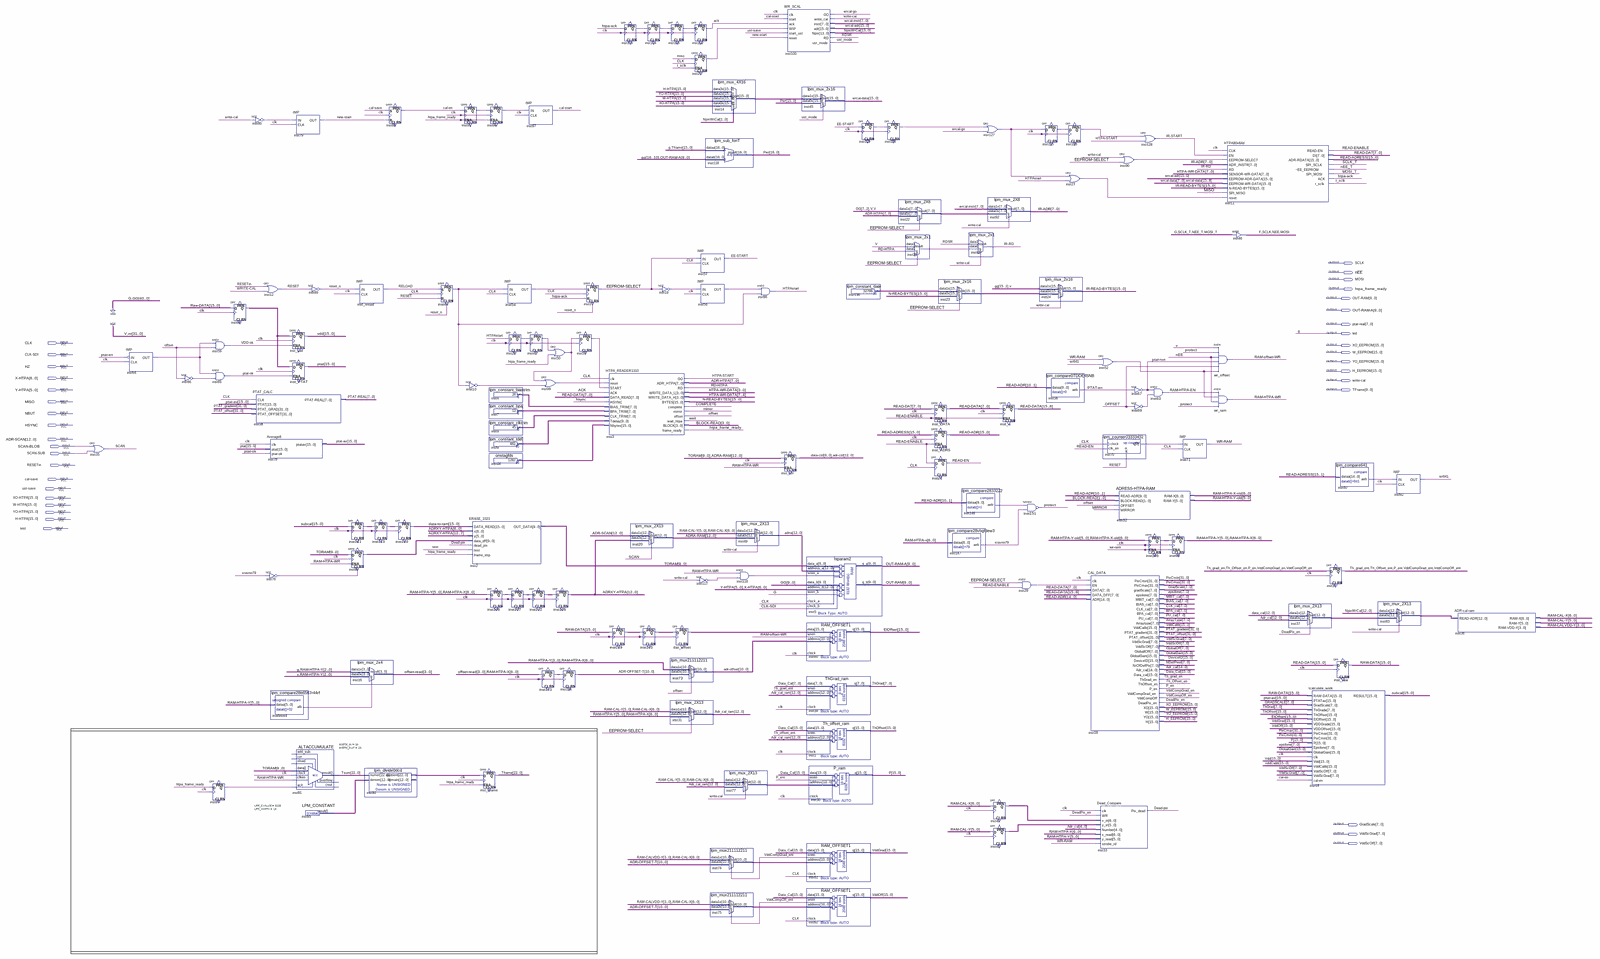
[diagram p0: schematic sheet, whole]
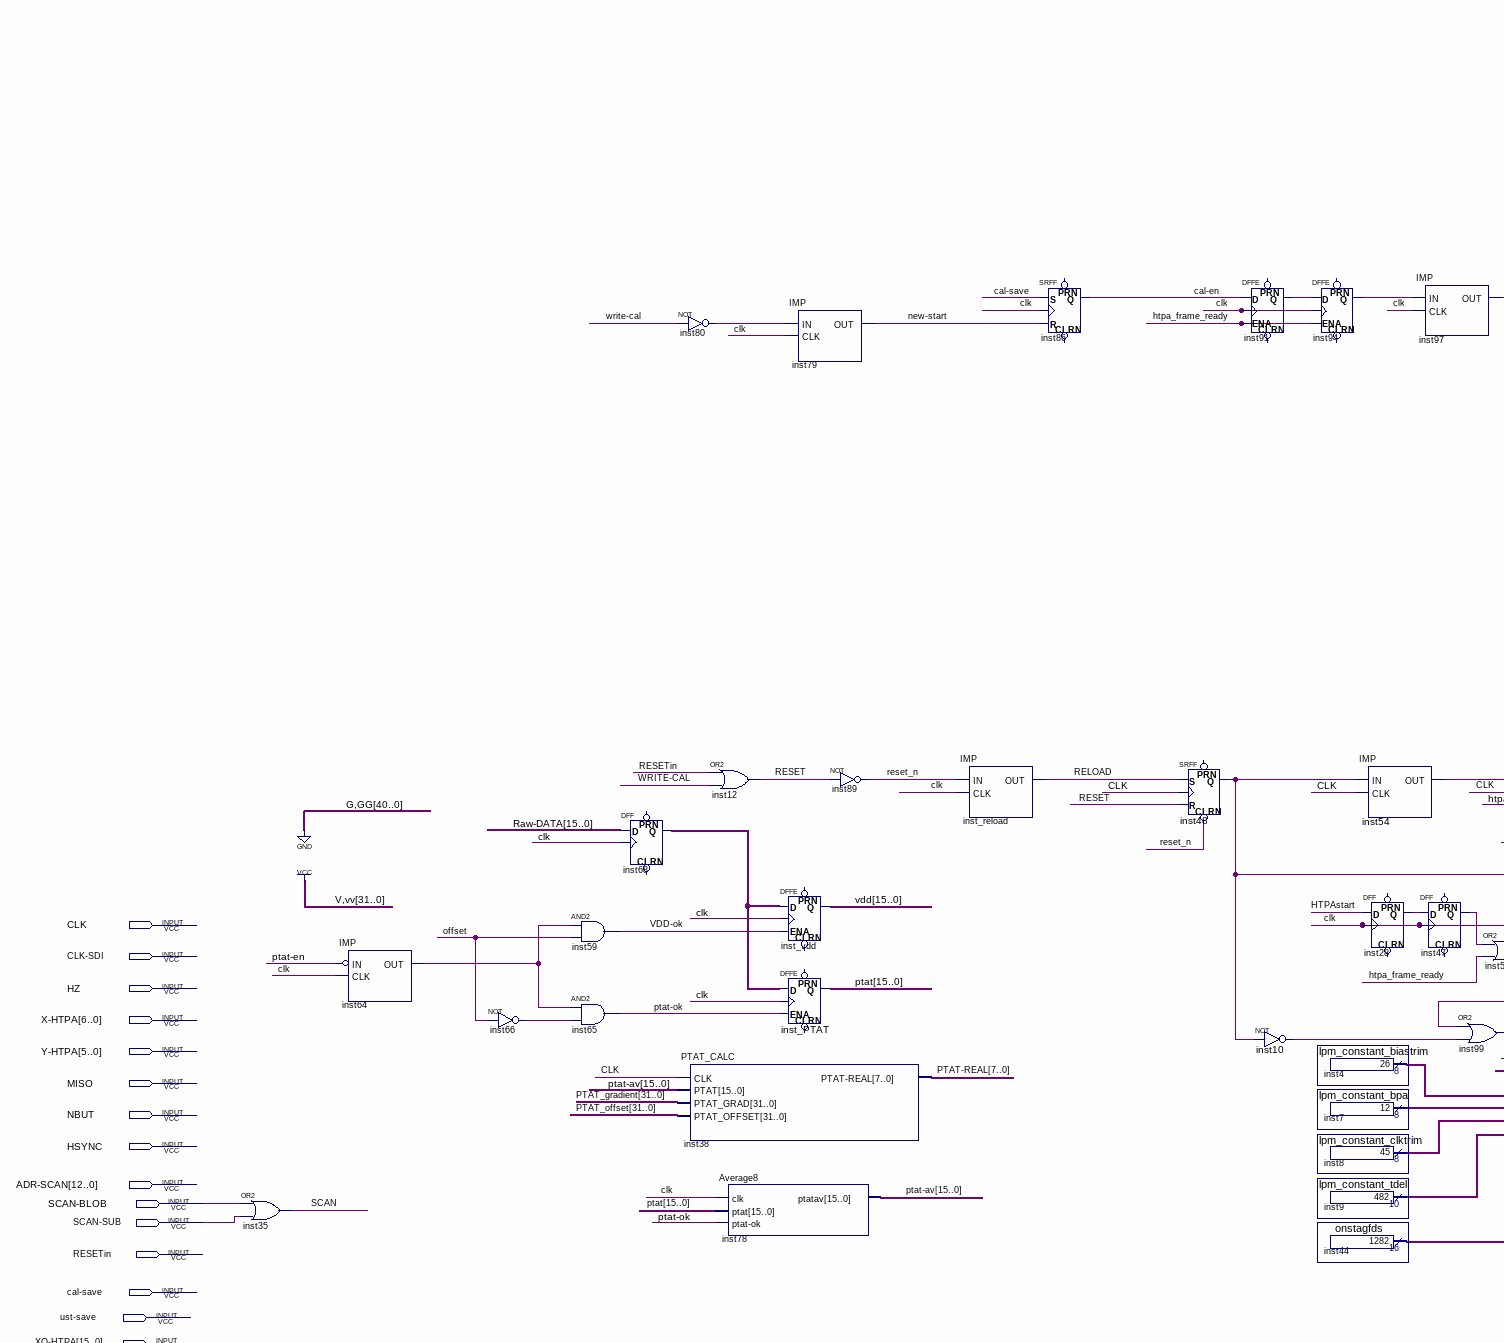
[diagram p1: schematic sheet, upper left part]
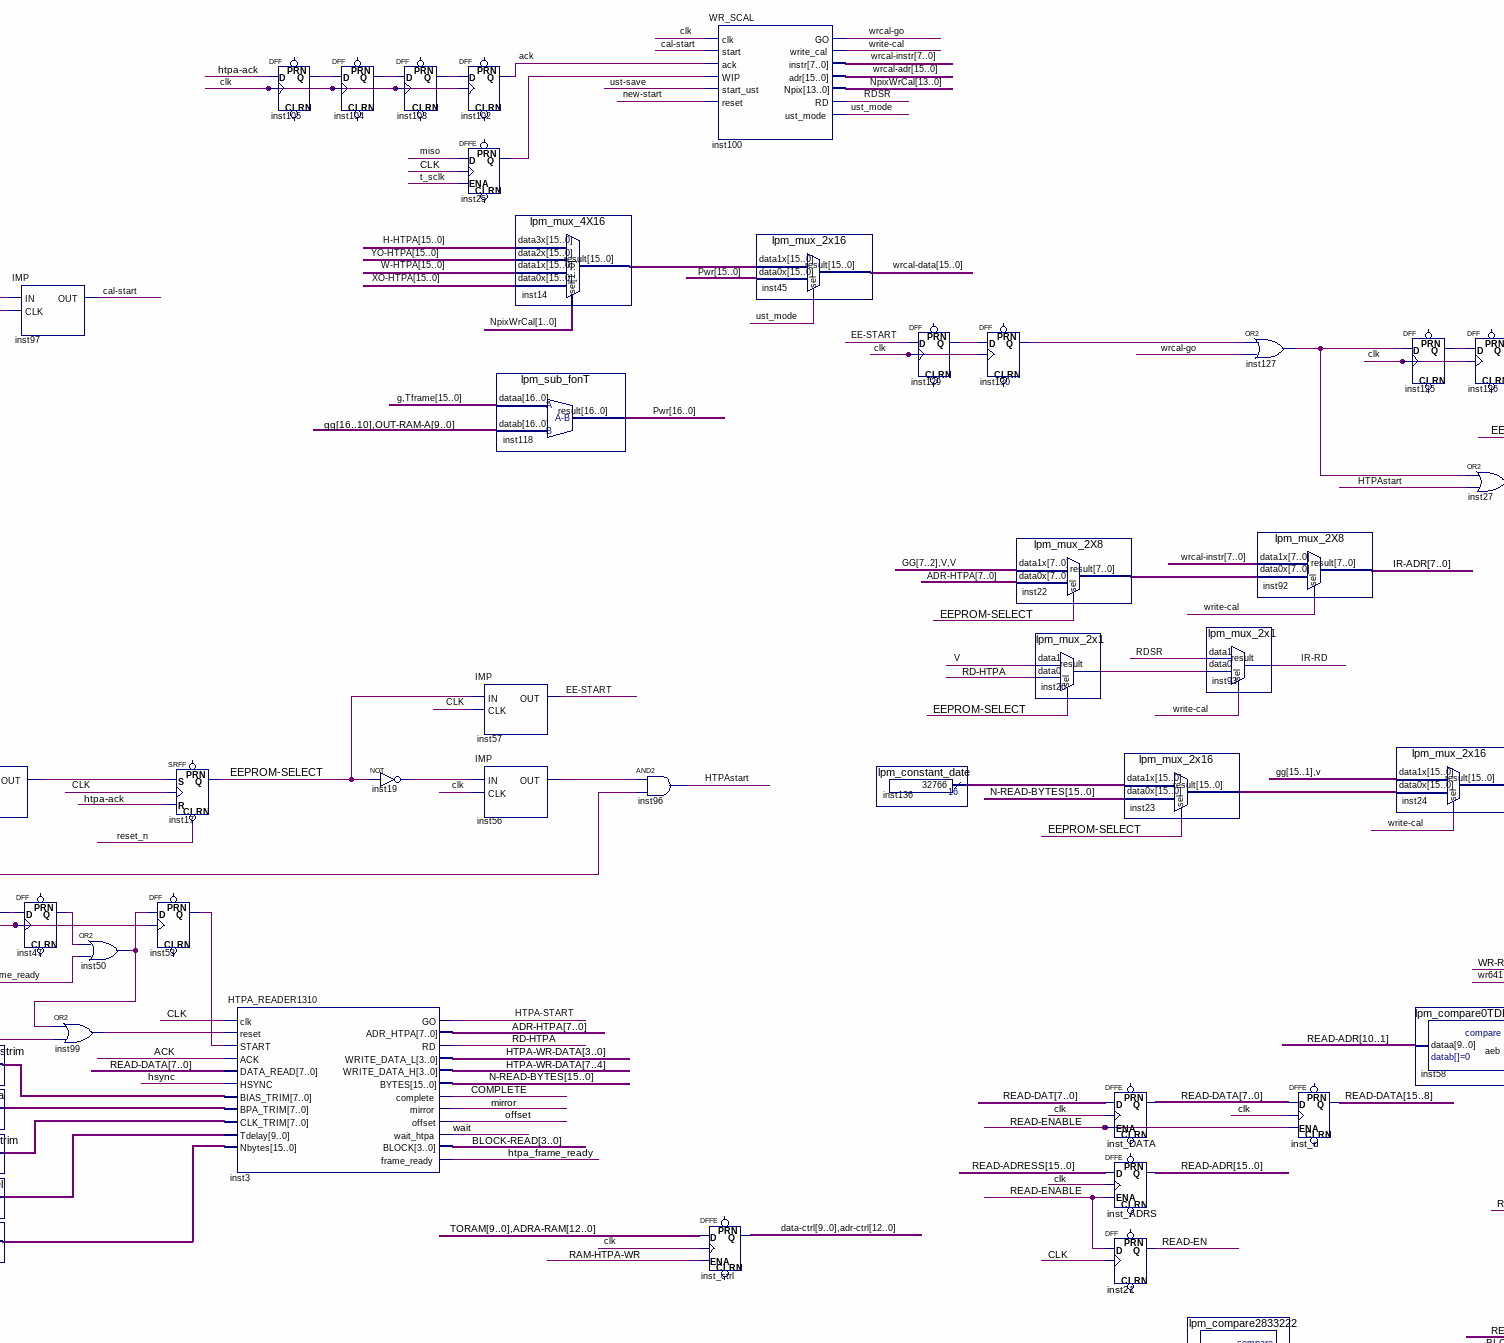
[diagram p2: schematic sheet, upper centre part]
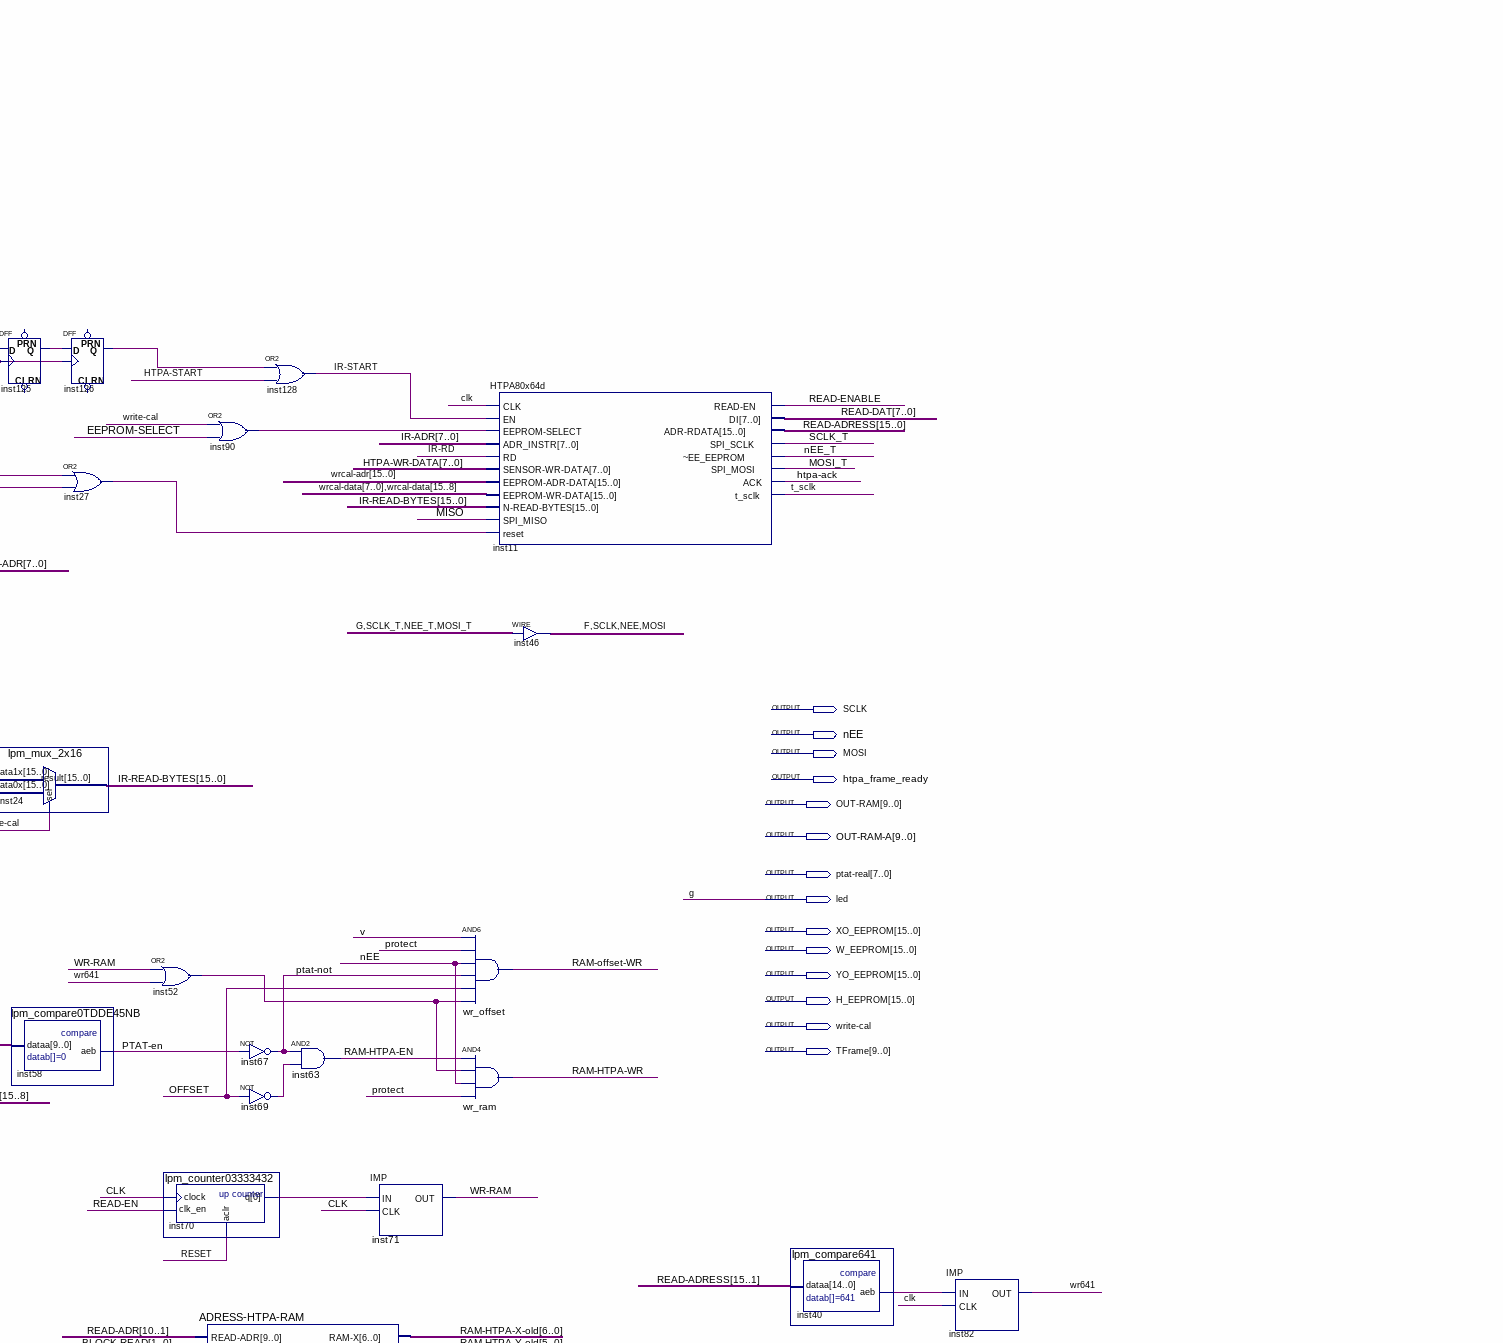
[diagram p3: schematic sheet, upper right part]
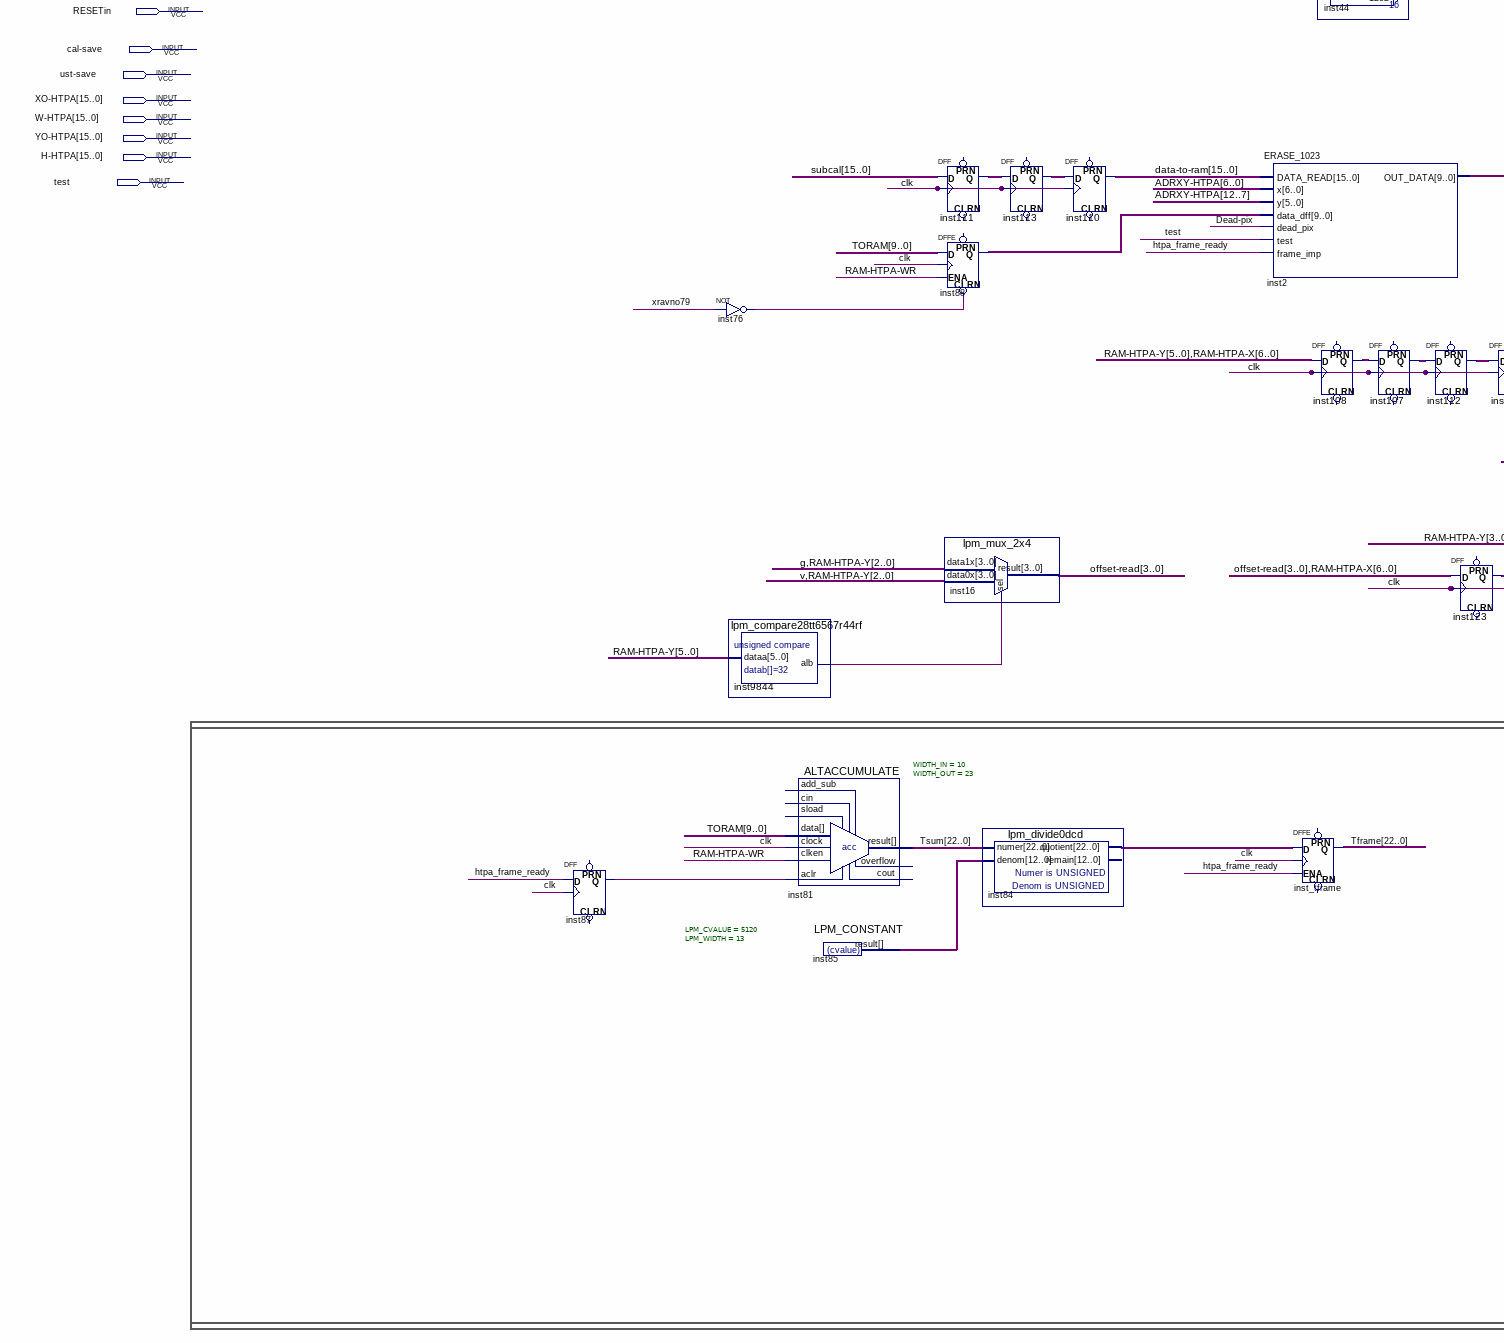
[diagram p4: schematic sheet, lower left part]
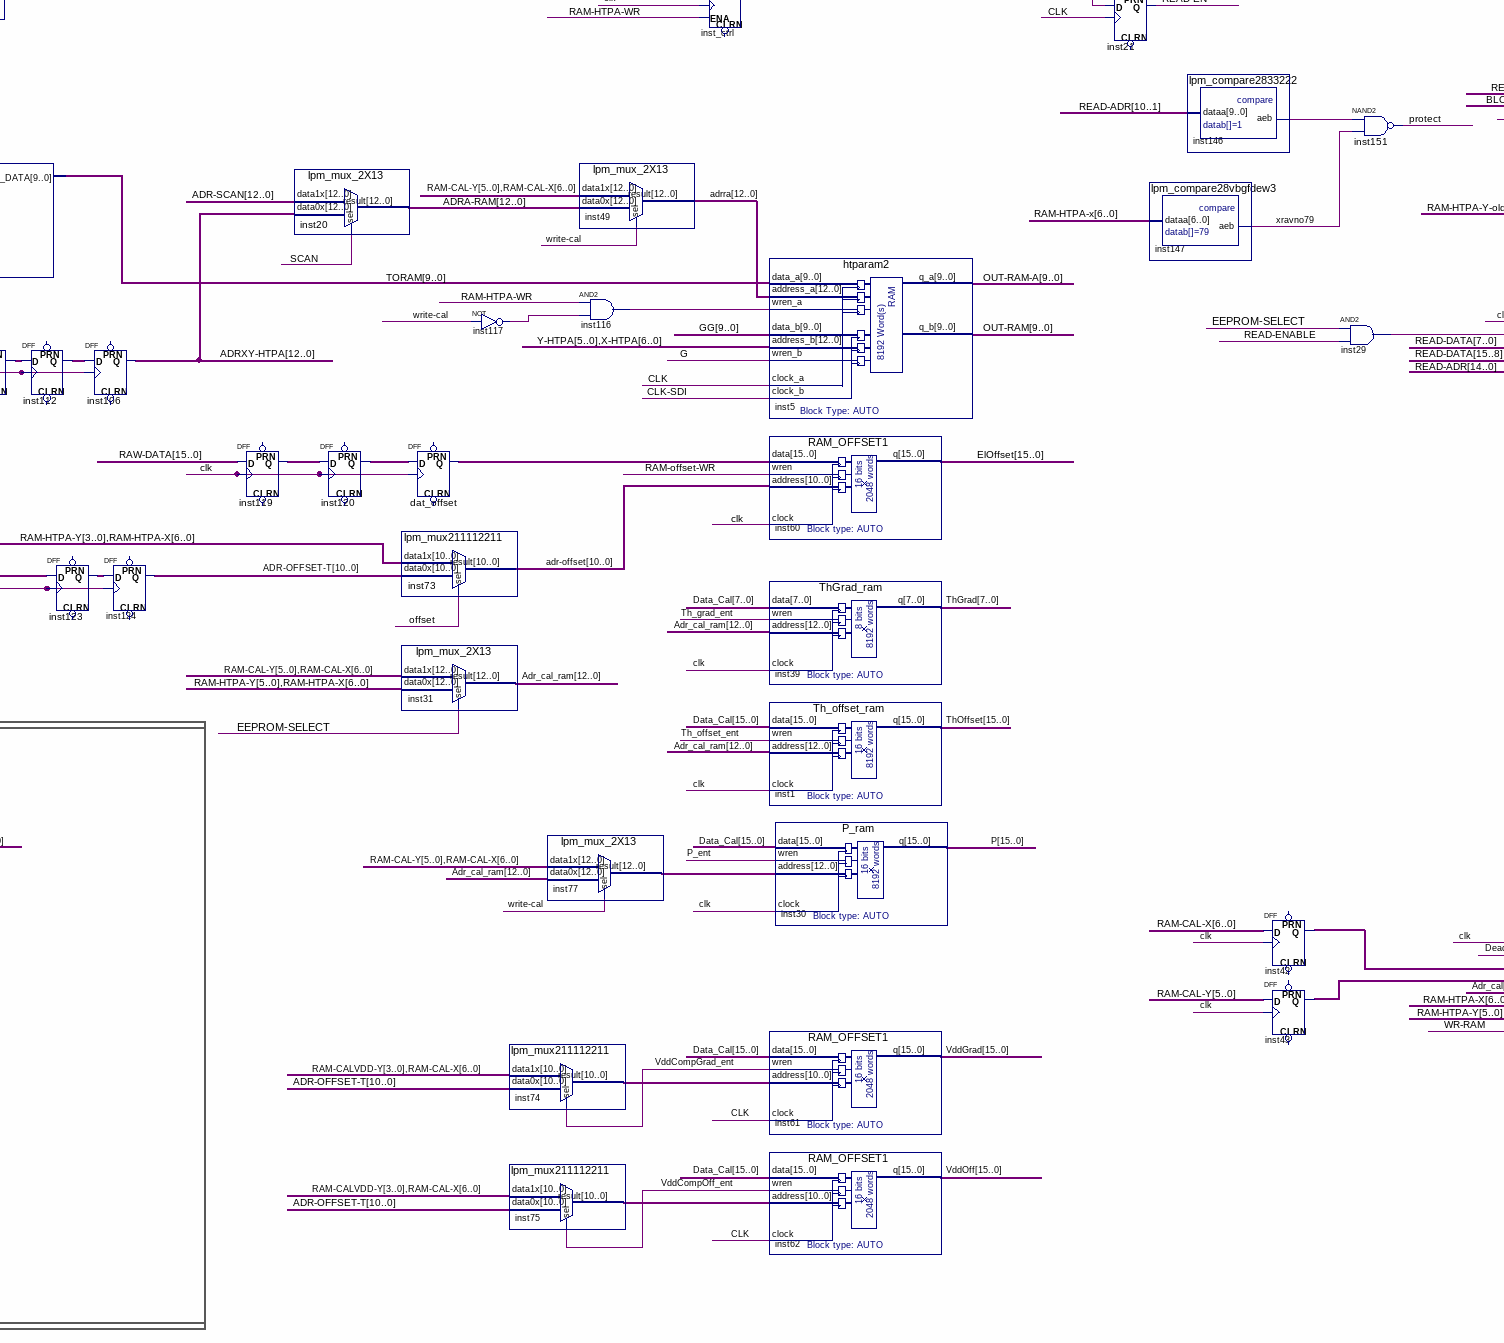
[diagram p5: schematic sheet, lower centre part]
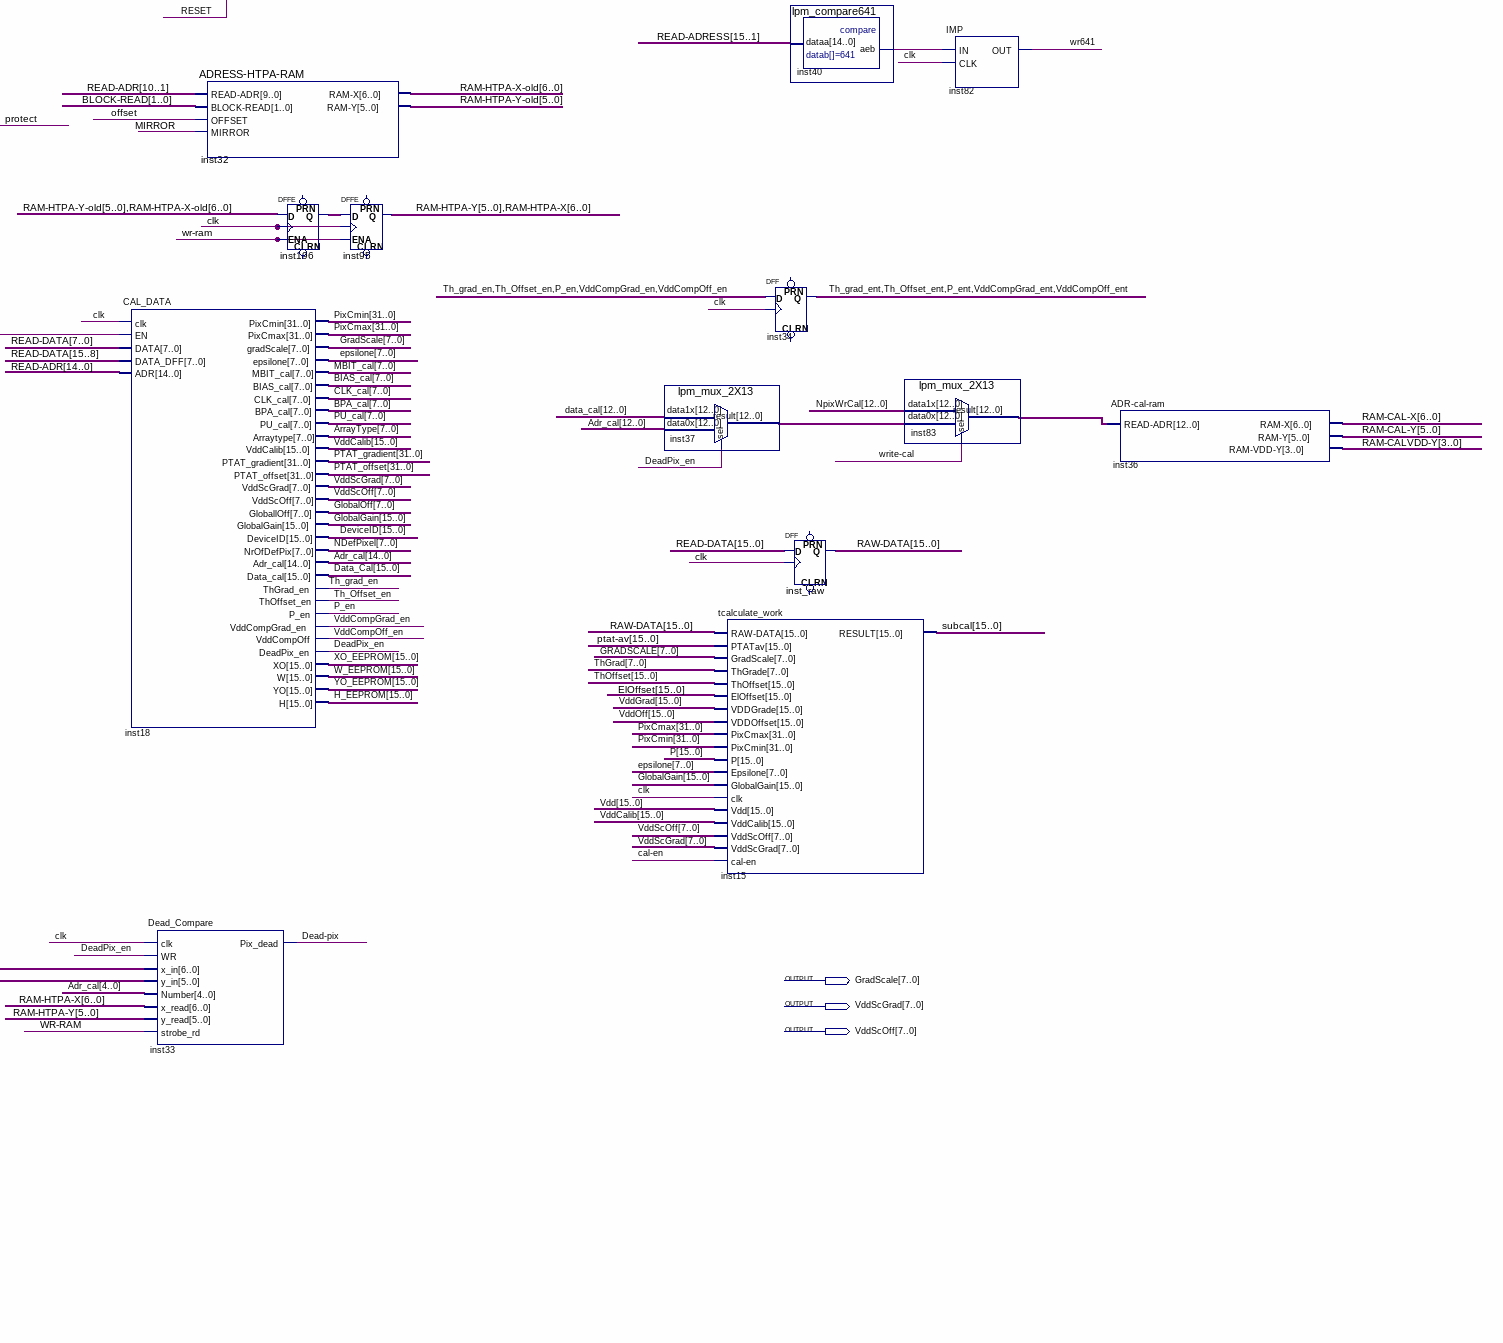
[diagram p6: schematic sheet, lower right part]
// Quartus schematic HTPA_MAIN_CAL.bdf as structural Verilog: 135 symbols, 36 pins
module HTPA_MAIN_CAL (
  input  CLK,
  input  \CLK-SDI ,
  input  HZ,
  input  [6:0] \X-HTPA ,
  input  [5:0] \Y-HTPA ,
  input  MISO,
  input  NBUT,
  input  HSYNC,
  input  [12:0] \ADR-SCAN ,
  input  \SCAN-BLOB ,
  input  \SCAN-SUB ,
  input  RESETin,
  input  \cal-save ,
  input  \ust-save ,
  input  [15:0] \XO-HTPA ,
  input  [15:0] \W-HTPA ,
  input  [15:0] \YO-HTPA ,
  input  [15:0] \H-HTPA ,
  input  test,
  output SCLK,
  output nEE,
  output MOSI,
  output htpa_frame_ready,
  output [9:0] \OUT-RAM ,
  output [9:0] \OUT-RAM-A ,
  output [7:0] \ptat-real ,
  output led,
  output [15:0] XO_EEPROM,
  output [15:0] W_EEPROM,
  output [15:0] YO_EEPROM,
  output [15:0] H_EEPROM,
  output \write-cal ,
  output [22:0] TFrame,
  output [7:0] GradScale,
  output [7:0] VddScGrad,
  output [7:0] VddScOff
);

  wire ACK, \cal-en , \cal-start , COMPLETE, \Dead-pix , DeadPix_en, \EE-START , \EEPROM-SELECT , F,
       \htpa-ack , \HTPA-START , HTPAstart, inst10_out, inst19_out, inst25_q, inst26_result, inst27_out,
       inst28_q, inst29_out, inst40_aeb, inst47_q, inst48_q, inst50_out, inst52_out, inst53_q, inst54_out,
       inst56_out, inst64_out, inst66_out, inst69_out, inst70_q, inst76_out, inst80_out, inst87_q,
       inst90_out, inst91_q, inst94_q, inst99_out, inst103_q, inst104_q, inst105_q, inst116_out, inst117_out,
       inst125_q, inst126_q, inst127_out, inst129_q, inst130_q, inst146_aeb, inst9844_alb, \IR-RD ,
       \IR-START , mirror, MOSI_T, NEE_T, \new-start , offset, P_en, P_ent, protect, \PTAT-en , \ptat-not ,
       \ptat-ok , \RAM-HTPA-EN , \RAM-HTPA-WR , \RAM-offset-WR , \RD-HTPA , RDSR, \READ-EN , \READ-ENABLE ,
       RELOAD, RESET, reset_n, SCAN, SCLK_T, t_sclk, Th_grad_en, Th_grad_ent, Th_Offset_en, Th_offset_ent,
       ust_mode, \VDD-ok , VddCompGrad_en, VddCompGrad_ent, VddCompOff_en, VddCompOff_ent, \wait , wr641,
       \wr-ram , \wrcal-go , xravno79;
  wire [3:0] \BLOCK-READ , \offset-read , \RAM-CALVDD-Y ;
  wire [5:0] inst43_q, \RAM-CAL-Y , \RAM-HTPA-Y , \RAM-HTPA-Y-old ;
  wire [6:0] inst42_q, \RAM-CAL-X , \RAM-HTPA-X , \RAM-HTPA-X-old ;
  wire [7:0] \ADR-HTPA , ArrayType, BIAS_cal, BPA_cal, CLK_cal, epsilone, GlobalOff, \HTPA-WR-DATA ,
       inst4_result, inst7_result, inst8_result, inst22_result, \IR-ADR , MBIT_cal, NDefPixel, PU_cal,
       \READ-DAT , ThGrad, \wrcal-instr ;
  wire [9:0] \data-ctrl , inst9_result, inst88_q, TORAM;
  wire [10:0] \adr-offset , \ADR-OFFSET-T , inst74_result, inst75_result, inst123_q;
  wire [12:0] \adr-ctrl , Adr_cal_ram, \ADRA-RAM , adrra, \ADRXY-HTPA , inst37_result, inst77_result,
       inst83_result, inst85_result, inst107_q, inst108_q, inst112_q, inst196_q;
  wire [13:0] NpixWrCal;
  wire [14:0] Adr_cal;
  wire [15:0] dat_offset_q, \data-to-ram , Data_Cal, DeviceID, ElOffset, GlobalGain, inst14_result,
       inst23_result, inst44_result, inst68_q, inst111_q, inst113_q, inst119_q, inst120_q, inst136_result,
       \IR-READ-BYTES , \N-READ-BYTES , P, ptat, \ptat-av , \RAW-DATA , \READ-ADR , \READ-ADRESS ,
       \READ-DATA , subcal, ThOffset, vdd, VddCalib, VddGrad, VddOff, \wrcal-adr , \wrcal-data ;
  wire [16:0] Pwr;
  wire [22:0] inst84_quotient, Tsum;
  wire [31:0] PixCmax, PixCmin, PTAT_gradient, PTAT_offset;

  or inst35 (SCAN, \SCAN-BLOB , \SCAN-SUB );
  IMP inst64 (.IN(~\PTAT-en ), .CLK(CLK), .OUT(inst64_out));
  not inst66 (inst66_out, offset);
  and inst59 (\VDD-ok , inst64_out, offset);
  and inst65 (\ptat-ok , inst64_out, inst66_out);
  DFF inst87 (.CLK(CLK), .D(htpa_frame_ready), .Q(inst87_q));  // open: CLRN, PRN
  DFF inst68[15:0] (.CLK(CLK), .D(\RAW-DATA ), .Q(inst68_q));  // open: CLRN, PRN
  not inst80 (inst80_out, \write-cal );
  PTAT_CALC inst38 (
    .CLK(CLK), .PTAT(\ptat-av ), .PTAT_GRAD(PTAT_gradient), .PTAT_OFFSET(PTAT_offset),
    .\PTAT-REAL (\ptat-real ));
  or inst12 (RESET, RESETin, \write-cal );
  Average8 inst78 (.clk(CLK), .ptat(ptat), .\ptat-ok (\ptat-ok ), .ptatav(\ptat-av ));
  not inst76 (inst76_out, xravno79);
  lpm_compare28tt6567r44rf inst9844 (.dataa(\RAM-HTPA-Y ), .alb(inst9844_alb));
  IMP inst79 (.IN(inst80_out), .CLK(CLK), .OUT(\new-start ));
  DFFE inst_vdd[15:0] (.D(inst68_q), .CLK(CLK), .ENA(\VDD-ok ), .Q(vdd));  // open: PRN, CLRN
  DFFE inst_PTAT[15:0] (.D(inst68_q), .CLK(CLK), .ENA(\ptat-ok ), .Q(ptat));  // open: PRN, CLRN
  ALTACCUMULATE #(.WIDTH_IN(10), .WIDTH_OUT(23)) inst81 (
    .aclr(inst87_q), .clock(CLK), .clken(\RAM-HTPA-WR ), .data(TORAM), .result(Tsum));  // open: add_sub, cin, sload, cout, overflow
  not inst89 (reset_n, RESET);
  LPM_CONSTANT #(.LPM_CVALUE(5120), .LPM_WIDTH(13)) inst85 (.result(inst85_result));
  IMP inst_reload (.IN(reset_n), .CLK(CLK), .OUT(RELOAD));
  DFF inst111[15:0] (.CLK(CLK), .D(subcal), .Q(inst111_q));  // open: CLRN, PRN
  DFFE inst88[9:0] (.CLRN(inst76_out), .D(TORAM), .CLK(CLK), .ENA(\RAM-HTPA-WR ), .Q(inst88_q));  // open: PRN
  lpm_mux_2x4 inst16 (
    .data1x({1'b0, \RAM-HTPA-Y [2:0]}), .data0x({1'b1, \RAM-HTPA-Y [2:0]}), .sel(inst9844_alb),
    .result(\offset-read ));
  DFF inst113[15:0] (.CLK(CLK), .D(inst111_q), .Q(inst113_q));  // open: CLRN, PRN
  lpm_divide0dcd inst84 (.numer(Tsum), .denom(inst85_result), .quotient(inst84_quotient));  // open: remain
  SRFF inst86 (.S(\cal-save ), .R(\new-start ), .CLK(CLK), .Q(\cal-en ));  // open: PRN, CLRN
  DFF inst110[15:0] (.CLK(CLK), .D(inst113_q), .Q(\data-to-ram ));  // open: CLRN, PRN
  SRFF inst48 (.CLRN(reset_n), .S(RELOAD), .R(RESET), .CLK(CLK), .Q(inst48_q));  // open: PRN
  DFFE inst91 (.D(\cal-en ), .CLK(CLK), .ENA(htpa_frame_ready), .Q(inst91_q));  // open: PRN, CLRN
  not inst10 (inst10_out, inst48_q);
  ERASE_1023 inst2 (
    .DATA_READ(\data-to-ram ), .x(\ADRXY-HTPA [6:0]), .y(\ADRXY-HTPA [12:7]), .data_dff(inst88_q),
    .dead_pix(\Dead-pix ), .test(test), .frame_imp(htpa_frame_ready), .OUT_DATA(TORAM));
  DFFE inst94 (.D(inst91_q), .CLK(CLK), .ENA(htpa_frame_ready), .Q(inst94_q));  // open: PRN, CLRN
  DFF inst108[12:0] (.CLK(CLK), .D({\RAM-HTPA-Y , \RAM-HTPA-X }), .Q(inst108_q));  // open: CLRN, PRN
  DFFE inst_tframe[22:0] (.D(inst84_quotient), .CLK(CLK), .ENA(htpa_frame_ready), .Q(TFrame));  // open: PRN, CLRN
  IMP inst54 (.IN(inst48_q), .CLK(CLK), .OUT(inst54_out));
  DFF inst28 (.CLK(CLK), .D(HTPAstart), .Q(inst28_q));  // open: CLRN, PRN
  lpm_constant_biastrim inst4 (.result(inst4_result));
  lpm_constant_bpa inst7 (.result(inst7_result));
  lpm_constant_clktrim inst8 (.result(inst8_result));
  lpm_constant_tdel inst9 (.result(inst9_result));
  onstagfds inst44 (.result(inst44_result));
  IMP inst97 (.IN(inst94_q), .CLK(CLK), .OUT(\cal-start ));
  DFF inst107[12:0] (.CLK(CLK), .D(inst108_q), .Q(inst107_q));  // open: CLRN, PRN
  DFF inst47 (.CLK(CLK), .D(inst28_q), .Q(inst47_q));  // open: CLRN, PRN
  or inst99 (inst99_out, inst50_out, inst10_out);
  DFF inst112[12:0] (.CLK(CLK), .D(inst107_q), .Q(inst112_q));  // open: CLRN, PRN
  DFF inst123[10:0] (.CLK(CLK), .D({\offset-read , \RAM-HTPA-X }), .Q(inst123_q));  // open: CLRN, PRN
  or inst50 (inst50_out, inst47_q, htpa_frame_ready);
  DFF inst106[12:0] (.CLK(CLK), .D(inst112_q), .Q(\ADRXY-HTPA ));  // open: CLRN, PRN
  DFF inst124[10:0] (.CLK(CLK), .D(inst123_q), .Q(\ADR-OFFSET-T ));  // open: CLRN, PRN
  DFF inst53 (.CLK(CLK), .D(inst50_out), .Q(inst53_q));  // open: CLRN, PRN
  SRFF inst17 (.CLRN(reset_n), .S(inst54_out), .R(\htpa-ack ), .CLK(CLK), .Q(\EEPROM-SELECT ));  // open: PRN
  HTPA_READER1310 inst3 (
    .clk(CLK), .reset(inst99_out), .START(inst53_q), .ACK(ACK), .DATA_READ(\READ-DATA [7:0]), .HSYNC(HSYNC),
    .BIAS_TRIM(inst4_result), .BPA_TRIM(inst7_result), .CLK_TRIM(inst8_result), .Tdelay(inst9_result),
    .Nbytes(inst44_result), .GO(\HTPA-START ), .ADR_HTPA(\ADR-HTPA ), .RD(\RD-HTPA ),
    .WRITE_DATA_L(\HTPA-WR-DATA [3:0]), .WRITE_DATA_H(\HTPA-WR-DATA [7:4]), .BYTES(\N-READ-BYTES ),
    .complete(COMPLETE), .mirror(mirror), .offset(offset), .wait_htpa(\wait ), .BLOCK(\BLOCK-READ ),
    .frame_ready(htpa_frame_ready));
  DFF inst119[15:0] (.CLK(CLK), .D(\RAW-DATA ), .Q(inst119_q));  // open: CLRN, PRN
  DFF inst105 (.CLK(CLK), .D(\htpa-ack ), .Q(inst105_q));  // open: CLRN, PRN
  lpm_mux_2X13 inst20 (.data1x(\ADR-SCAN ), .data0x(\ADRXY-HTPA ), .sel(SCAN), .result(\ADRA-RAM ));
  DFF inst104 (.CLK(CLK), .D(inst105_q), .Q(inst104_q));  // open: CLRN, PRN
  DFF inst120[15:0] (.CLK(CLK), .D(inst119_q), .Q(inst120_q));  // open: CLRN, PRN
  DFF inst103 (.CLK(CLK), .D(inst104_q), .Q(inst103_q));  // open: CLRN, PRN
  not inst19 (inst19_out, \EEPROM-SELECT );
  DFF dat_offset[15:0] (.CLK(CLK), .D(inst120_q), .Q(dat_offset_q));  // open: CLRN, PRN
  lpm_mux211112211 inst73 (
    .data1x({\RAM-HTPA-Y [3:0], \RAM-HTPA-X }), .data0x(\ADR-OFFSET-T ), .sel(offset), .result(\adr-offset ));
  lpm_mux_2X13 inst31 (
    .data1x({\RAM-CAL-Y , \RAM-CAL-X }), .data0x({\RAM-HTPA-Y , \RAM-HTPA-X }), .sel(\EEPROM-SELECT ),
    .result(Adr_cal_ram));
  DFF inst102 (.CLK(CLK), .D(inst103_q), .Q(ACK));  // open: CLRN, PRN
  DFFE inst25 (.D(MISO), .CLK(CLK), .ENA(t_sclk), .Q(inst25_q));  // open: PRN, CLRN
  lpm_mux_4X16 inst14 (
    .data3x(\H-HTPA ), .data2x(\YO-HTPA ), .data1x(\W-HTPA ), .data0x(\XO-HTPA ), .sel(NpixWrCal[1:0]),
    .result(inst14_result));
  lpm_sub_fonT inst118 (.dataa({1'b0, TFrame[15:0]}), .datab({{7{1'b0}}, \OUT-RAM-A }), .result(Pwr));
  IMP inst57 (.IN(\EEPROM-SELECT ), .CLK(CLK), .OUT(\EE-START ));
  IMP inst56 (.IN(inst19_out), .CLK(CLK), .OUT(inst56_out));
  not inst117 (inst117_out, \write-cal );
  lpm_mux211112211 inst74 (
    .data1x({\RAM-CALVDD-Y , \RAM-CAL-X }), .data0x(\ADR-OFFSET-T ), .sel(VddCompGrad_ent),
    .result(inst74_result));
  lpm_mux211112211 inst75 (
    .data1x({\RAM-CALVDD-Y , \RAM-CAL-X }), .data0x(\ADR-OFFSET-T ), .sel(VddCompOff_ent),
    .result(inst75_result));
  lpm_mux_2X13 inst77 (
    .data1x({\RAM-CAL-Y , \RAM-CAL-X }), .data0x(Adr_cal_ram), .sel(\write-cal ), .result(inst77_result));
  lpm_mux_2X13 inst49 (.data1x({\RAM-CAL-Y , \RAM-CAL-X }), .data0x(\ADRA-RAM ), .sel(\write-cal ), .result(adrra));
  and inst116 (inst116_out, \RAM-HTPA-WR , inst117_out);
  and inst96 (HTPAstart, inst56_out, inst48_q);
  WR_SCAL inst100 (
    .clk(CLK), .start(\cal-start ), .ack(ACK), .WIP(inst25_q), .start_ust(\ust-save ), .reset(\new-start ),
    .GO(\wrcal-go ), .write_cal(\write-cal ), .instr(\wrcal-instr ), .adr(\wrcal-adr ), .Npix(NpixWrCal),
    .RD(RDSR), .ust_mode(ust_mode));
  DFFE inst_ctrl[22:0] (
    .D({TORAM, \ADRA-RAM }), .CLK(CLK), .ENA(\RAM-HTPA-WR ), .Q({\data-ctrl , \adr-ctrl }));  // open: PRN, CLRN
  lpm_mux_2x16 inst45 (.data1x(inst14_result), .data0x(Pwr[15:0]), .sel(ust_mode), .result(\wrcal-data ));
  htparam2 inst5 (
    .data_a(TORAM), .address_a(adrra), .wren_a(inst116_out), .data_b({10{1'b0}}),
    .address_b({\Y-HTPA , \X-HTPA }), .wren_b(1'b0), .clock_a(CLK), .clock_b(\CLK-SDI ), .q_a(\OUT-RAM-A ),
    .q_b(\OUT-RAM ));
  RAM_OFFSET1 inst60 (.data(dat_offset_q), .wren(\RAM-offset-WR ), .address(\adr-offset ), .clock(CLK), .q(ElOffset));
  ThGrad_ram inst39 (.data(Data_Cal[7:0]), .wren(Th_grad_ent), .address(Adr_cal_ram), .clock(CLK), .q(ThGrad));
  Th_offset_ram inst1 (.data(Data_Cal), .wren(Th_offset_ent), .address(Adr_cal_ram), .clock(CLK), .q(ThOffset));
  RAM_OFFSET1 inst61 (.data(Data_Cal), .wren(VddCompGrad_ent), .address(inst74_result), .clock(CLK), .q(VddGrad));
  RAM_OFFSET1 inst62 (.data(Data_Cal), .wren(VddCompOff_ent), .address(inst75_result), .clock(CLK), .q(VddOff));
  P_ram inst30 (.data(Data_Cal), .wren(P_ent), .address(inst77_result), .clock(CLK), .q(P));
  DFF inst129 (.CLK(CLK), .D(\EE-START ), .Q(inst129_q));  // open: CLRN, PRN
  lpm_constant_date inst136 (.result(inst136_result));
  DFF inst130 (.CLK(CLK), .D(inst129_q), .Q(inst130_q));  // open: CLRN, PRN
  lpm_mux_2X8 inst22 (.data1x(8'b00000011), .data0x(\ADR-HTPA ), .sel(\EEPROM-SELECT ), .result(inst22_result));
  lpm_mux_2x1 inst26 (.data1(1'b1), .data0(\RD-HTPA ), .sel(\EEPROM-SELECT ), .result(inst26_result));
  lpm_mux_2x16 inst23 (.data1x(inst136_result), .data0x(\N-READ-BYTES ), .sel(\EEPROM-SELECT ), .result(inst23_result));
  DFFE inst_DATA[7:0] (.D(\READ-DAT ), .CLK(CLK), .ENA(\READ-ENABLE ), .Q(\READ-DATA [7:0]));  // open: PRN, CLRN
  DFFE inst_ADRS[15:0] (.D(\READ-ADRESS ), .CLK(CLK), .ENA(\READ-ENABLE ), .Q(\READ-ADR ));  // open: PRN, CLRN
  DFF inst21 (.CLK(CLK), .D(\READ-ENABLE ), .Q(\READ-EN ));  // open: CLRN, PRN
  lpm_compare28vbgfdew3 inst147 (.dataa(\RAM-HTPA-X ), .aeb(xravno79));
  lpm_mux_2x1 inst93 (.data1(RDSR), .data0(inst26_result), .sel(\write-cal ), .result(\IR-RD ));
  lpm_compare2833222 inst146 (.dataa(\READ-ADR [10:1]), .aeb(inst146_aeb));
  or inst127 (inst127_out, inst130_q, \wrcal-go );
  lpm_mux_2X8 inst92 (.data1x(\wrcal-instr ), .data0x(inst22_result), .sel(\write-cal ), .result(\IR-ADR ));
  DFF inst42[6:0] (.CLK(CLK), .D(\RAM-CAL-X ), .Q(inst42_q));  // open: CLRN, PRN
  DFF inst43[5:0] (.CLK(CLK), .D(\RAM-CAL-Y ), .Q(inst43_q));  // open: CLRN, PRN
  DFFE inst_d[7:0] (.D(\READ-DATA [7:0]), .CLK(CLK), .ENA(\READ-ENABLE ), .Q(\READ-DATA [15:8]));  // open: PRN, CLRN
  nand inst151 (protect, inst146_aeb, xravno79);
  and inst29 (inst29_out, \EEPROM-SELECT , \READ-ENABLE );
  DFF inst125 (.CLK(CLK), .D(inst127_out), .Q(inst125_q));  // open: CLRN, PRN
  lpm_mux_2x16 inst24 (
    .data1x(16'b0000000000000001), .data0x(inst23_result), .sel(\write-cal ), .result(\IR-READ-BYTES ));
  lpm_compare0TDDE45NB inst58 (.dataa(\READ-ADR [10:1]), .aeb(\PTAT-en ));
  DFF inst126 (.CLK(CLK), .D(inst125_q), .Q(inst126_q));  // open: CLRN, PRN
  or inst27 (inst27_out, inst127_out, HTPAstart);
  CAL_DATA inst18 (
    .clk(CLK), .EN(inst29_out), .DATA(\READ-DATA [7:0]), .DATA_DFF(\READ-DATA [15:8]),
    .ADR(\READ-ADR [14:0]), .PixCmin(PixCmin), .PixCmax(PixCmax), .gradScale(GradScale), .epsilone(epsilone),
    .MBIT_cal(MBIT_cal), .BIAS_cal(BIAS_cal), .CLK_cal(CLK_cal), .BPA_cal(BPA_cal), .PU_cal(PU_cal),
    .Arraytype(ArrayType), .VddCalib(VddCalib), .PTAT_gradient(PTAT_gradient), .PTAT_offset(PTAT_offset),
    .VddScGrad(VddScGrad), .VddScOff(VddScOff), .GloballOff(GlobalOff), .GlobalGain(GlobalGain),
    .DeviceID(DeviceID), .NrOfDefPix(NDefPixel), .Adr_cal(Adr_cal), .Data_cal(Data_Cal),
    .ThGrad_en(Th_grad_en), .ThOffset_en(Th_Offset_en), .P_en(P_en), .VddCompGrad_en(VddCompGrad_en),
    .VddCompOff(VddCompOff_en), .DeadPix_en(DeadPix_en), .XO(XO_EEPROM), .W(W_EEPROM), .YO(YO_EEPROM),
    .H(H_EEPROM));
  or inst52 (inst52_out, \wr-ram , wr641);
  lpm_counter03333432 inst70 (.clock(CLK), .clk_en(\READ-EN ), .aclr(RESET), .q(inst70_q));
  Dead_Compare inst33 (
    .clk(CLK), .WR(DeadPix_en), .x_in(inst42_q), .y_in(inst43_q), .Number(Adr_cal[4:0]),
    .x_read(\RAM-HTPA-X ), .y_read(\RAM-HTPA-Y ), .strobe_rd(\wr-ram ), .Pix_dead(\Dead-pix ));
  or inst90 (inst90_out, \write-cal , \EEPROM-SELECT );
  \ADRESS-HTPA-RAM  inst32 (
    .\READ-ADR (\READ-ADR [10:1]), .\BLOCK-READ (\BLOCK-READ [1:0]), .OFFSET(offset), .MIRROR(mirror),
    .\RAM-X (\RAM-HTPA-X-old ), .\RAM-Y (\RAM-HTPA-Y-old ));
  or inst128 (\IR-START , inst126_q, \HTPA-START );
  not inst67 (\ptat-not , \PTAT-en );
  not inst69 (inst69_out, offset);
  DFFE inst196[12:0] (
    .D({\RAM-HTPA-Y-old , \RAM-HTPA-X-old }), .CLK(CLK), .ENA(\wr-ram ), .Q(inst196_q));  // open: PRN, CLRN
  and inst63 (\RAM-HTPA-EN , \ptat-not , inst69_out);
  IMP inst71 (.IN(inst70_q), .CLK(CLK), .OUT(\wr-ram ));
  DFFE inst95[12:0] (.D(inst196_q), .CLK(CLK), .ENA(\wr-ram ), .Q({\RAM-HTPA-Y , \RAM-HTPA-X }));  // open: PRN, CLRN
  and wr_offset (\RAM-offset-WR , 1'b1, protect, nEE, \ptat-not , offset, inst52_out);
  and wr_ram (\RAM-HTPA-WR , \RAM-HTPA-EN , inst52_out, nEE, protect);
  HTPA80x64d inst11 (
    .CLK(CLK), .EN(\IR-START ), .\EEPROM-SELECT (inst90_out), .ADR_INSTR(\IR-ADR ), .RD(\IR-RD ),
    .\SENSOR-WR-DATA (\HTPA-WR-DATA ), .\EEPROM-ADR-DATA (\wrcal-adr ),
    .\EEPROM-WR-DATA ({\wrcal-data [7:0], \wrcal-data [15:8]}), .\N-READ-BYTES (\IR-READ-BYTES ),
    .SPI_MISO(MISO), .reset(inst27_out), .\READ-EN (\READ-ENABLE ), .DI(\READ-DAT ),
    .\ADR-RDATA (\READ-ADRESS ), .SPI_SCLK(SCLK_T), .\~EE_EEPROM (NEE_T), .SPI_MOSI(MOSI_T),
    .ACK(\htpa-ack ), .t_sclk(t_sclk));
  assign {F, SCLK, nEE, MOSI} = {1'b0, SCLK_T, NEE_T, MOSI_T};  // WIRE inst46
  lpm_mux_2X13 inst37 (.data1x(Data_Cal[12:0]), .data0x(Adr_cal[12:0]), .sel(DeadPix_en), .result(inst37_result));
  tcalculate_work inst15 (
    .\RAW-DATA (\RAW-DATA ), .PTATav(\ptat-av ), .GradScale(GradScale), .ThGrade(ThGrad),
    .ThOffset(ThOffset), .ElOffset(ElOffset), .VDDGrade(VddGrad), .VDDOffset(VddOff), .PixCmax(PixCmax),
    .PixCmin(PixCmin), .P(P), .Epsilone(epsilone), .GlobalGain(GlobalGain), .clk(CLK), .Vdd(vdd),
    .VddCalib(VddCalib), .VddScOff(VddScOff), .VddScGrad(VddScGrad), .\cal-en (\cal-en ), .RESULT(subcal));
  DFF inst34[4:0] (
    .CLK(CLK), .D({Th_grad_en, Th_Offset_en, P_en, VddCompGrad_en, VddCompOff_en}),
    .Q({Th_grad_ent, Th_offset_ent, P_ent, VddCompGrad_ent, VddCompOff_ent}));  // open: CLRN, PRN
  DFF inst_raw[15:0] (.CLK(CLK), .D(\READ-DATA ), .Q(\RAW-DATA ));  // open: CLRN, PRN
  lpm_compare641 inst40 (.dataa(\READ-ADRESS [15:1]), .aeb(inst40_aeb));
  lpm_mux_2X13 inst83 (.data1x(NpixWrCal[12:0]), .data0x(inst37_result), .sel(\write-cal ), .result(inst83_result));
  IMP inst82 (.IN(inst40_aeb), .CLK(CLK), .OUT(wr641));
  \ADR-cal-ram  inst36 (
    .\READ-ADR (inst83_result), .\RAM-X (\RAM-CAL-X ), .\RAM-Y (\RAM-CAL-Y ), .\RAM-VDD-Y (\RAM-CALVDD-Y ));

  assign led = 1'b0;
endmodule
